# Altium schematic sheet Connectors_GPIOs.SchDoc
size A3
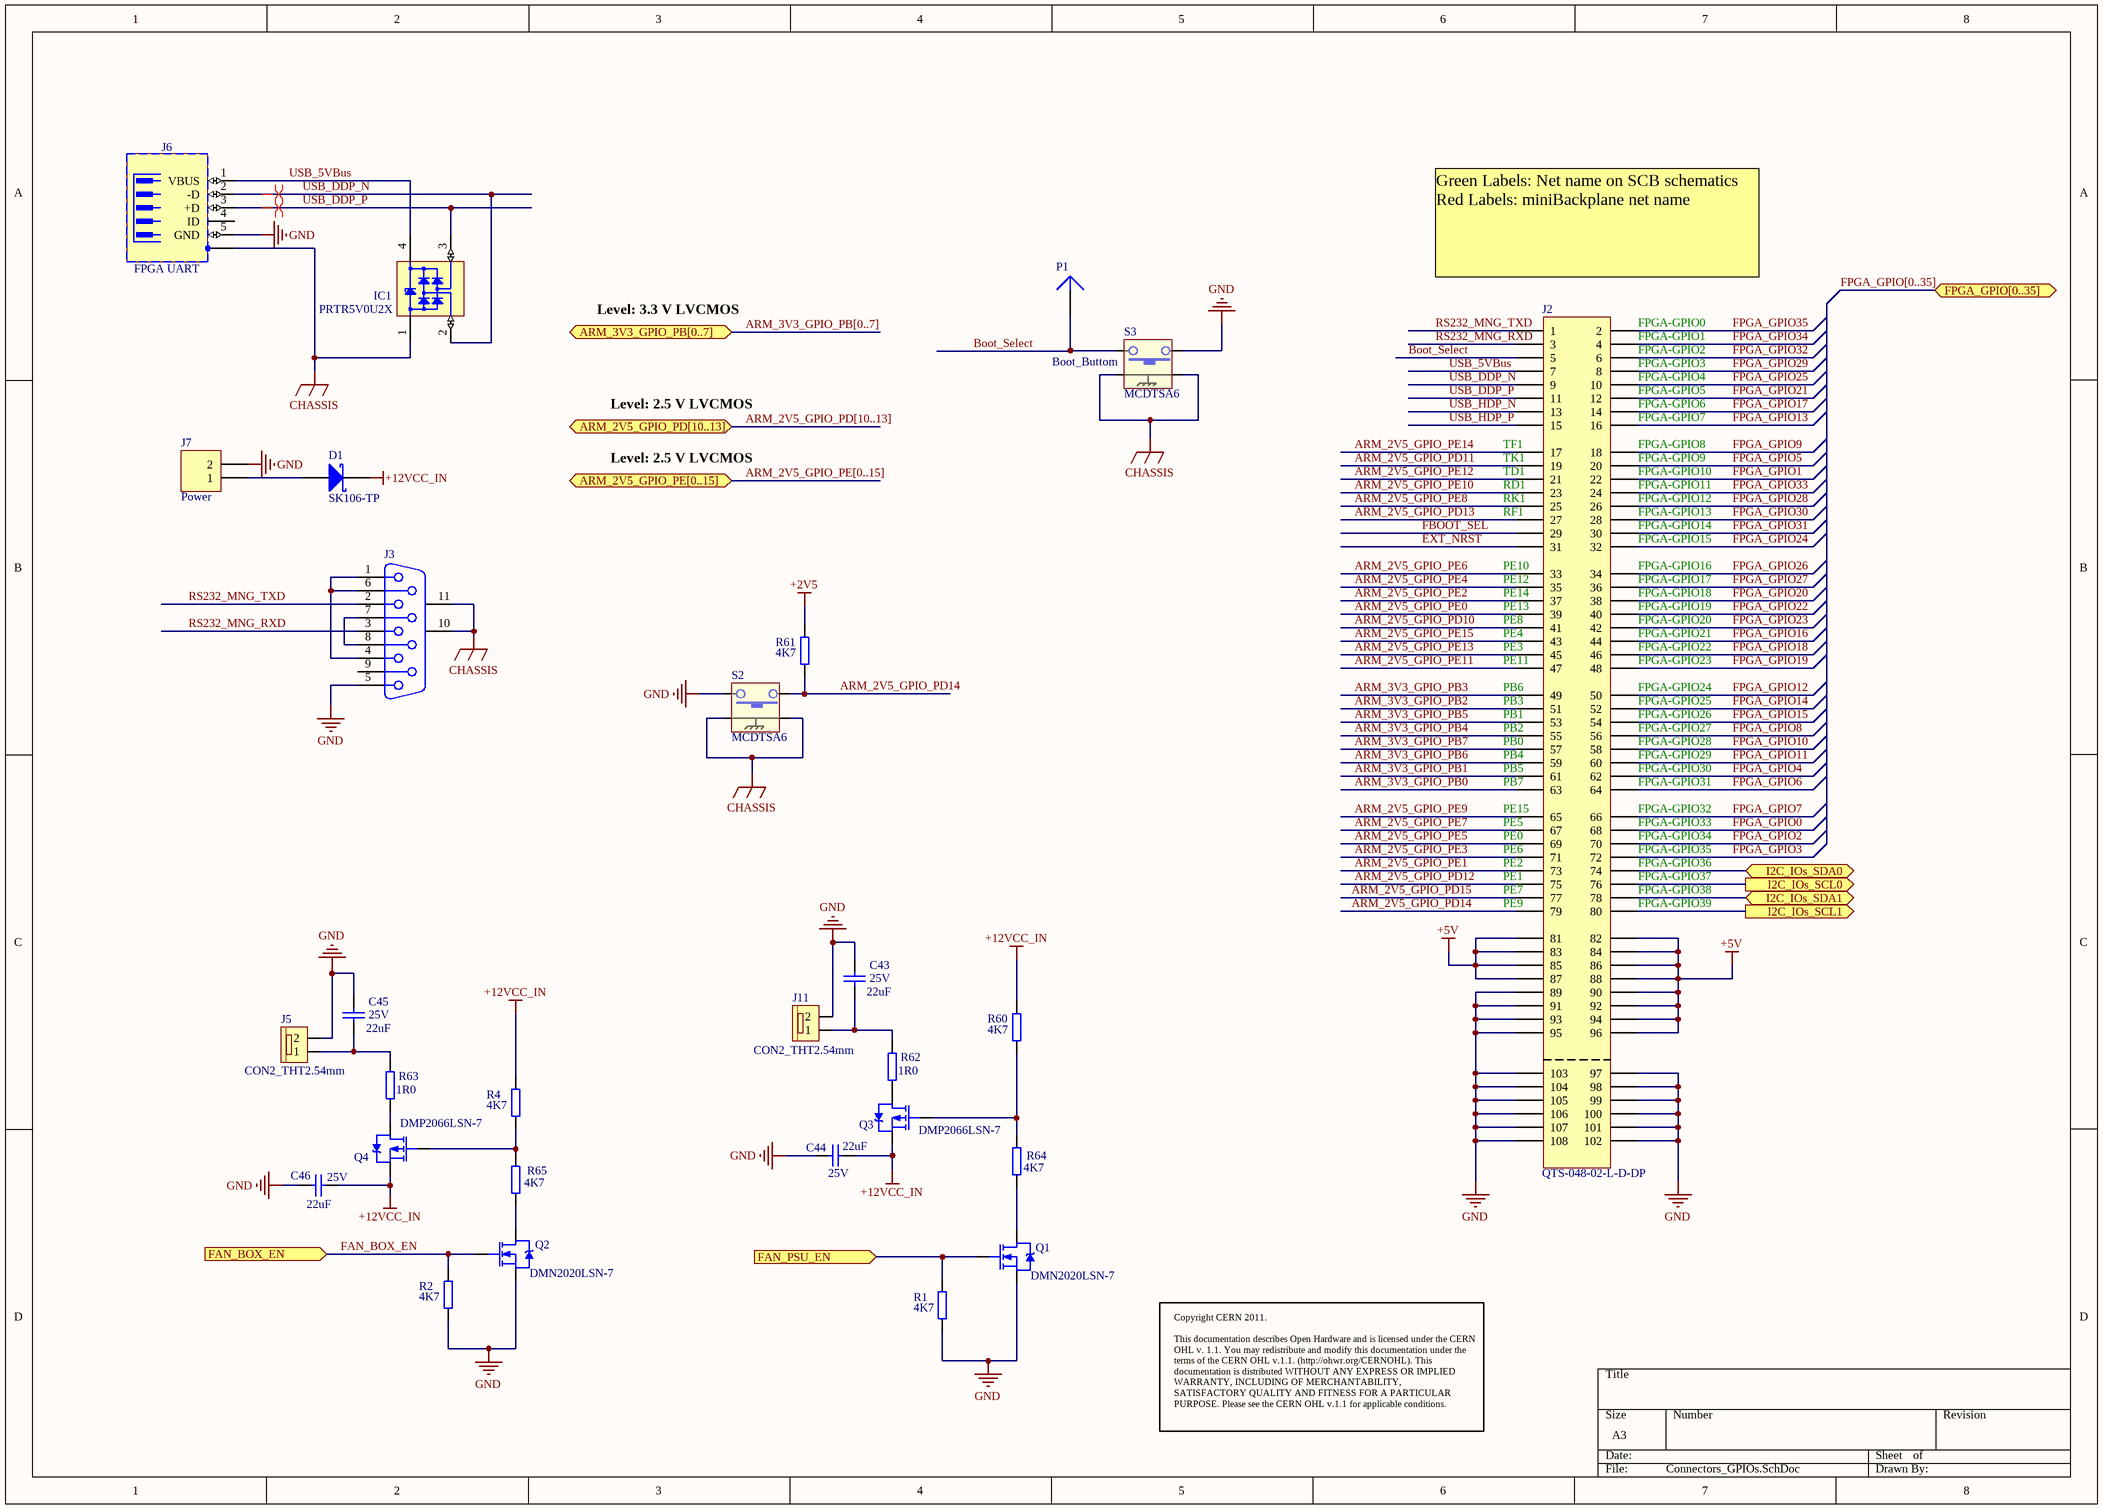
[diagram p0: Connectors_GPIOs.SchDoc]

## Parts
C43  value 22uF  Voltage: 25V  [CC3216-1206]  (hidden comment: 22uF 25V)
C44  value 22uF  Voltage: 25V  [CC3216-1206]  (hidden comment: 22uF 25V)
C45  value 22uF  Voltage: 25V  [CC3216-1206]  (hidden comment: 22uF 25V)
C46  value 22uF  Voltage: 25V  [CC3216-1206]  (hidden comment: 22uF 25V)
D1  SK106-TP  [DO-214AB/SMB-MCC]
IC1  PRTR5V0U2X  [SOT190P230X110-4N]
J2  QTS-048-02-L-D-DP  [QTS-048-XX-X-D-DP-A]
J3  D Connector 9  [DSUB1.385-2H9]  (value not drawn)
J5  CON2_THT2.54mm  [Wurth_619_0xx]
J6  FPGA UART  [TYCO_1734035-1]
J7  Power  [TYCO_794120_1]
J11  CON2_THT2.54mm  [Wurth_619_0xx]
P1  Boot_Buttom  [PIN1-RT-01T-1.0B(LF)]
Q1  DMN2020LSN-7  [SC-59-3]
Q2  DMN2020LSN-7  [SC-59-3]
Q3  DMP2066LSN-7  [SC-59-3]
Q4  DMP2066LSN-7  [SC-59-3]
R1  4K7  [0603]
R2  4K7  [0603]
R4  4K7  [0603]
R60  4K7  [0603]
R61  4K7  [0603]
R62  1R0  [CR3225-1210]
R63  1R0  [CR3225-1210]
R64  4K7  [0603]
R65  4K7  [0603]
S2  MCDTSA6  [MCDTSA6]
S3  MCDTSA6  [MCDTSA6]

## Ports
ARM_2V5_GPIO_PD[10..13] (bidir), ARM_2V5_GPIO_PE[0..15] (bidir), ARM_3V3_GPIO_PB[0..7] (bidir), FAN_BOX_EN (in), FAN_PSU_EN (in), FPGA_GPIO[0..35] (bidir), I2C_IOs_SCL0 (out), I2C_IOs_SCL1 (out), I2C_IOs_SDA0 (bidir), I2C_IOs_SDA1 (bidir)

## Nets
+2V5: R61.1
+5V: J2.81 J2.82 J2.83 J2.84 J2.85 J2.86 J2.87 J2.88 J2.90 J2.92 J2.94 J2.96
+12VCC_IN: C44.1 C46.1 D1.1(K) Q3.3(S) Q4.3(S) R4.1 R60.1
CHASSIS: IC1.1(GND) J3.10(MH1) J3.11(MH2) J6.6(SH) S2.3 S2.4 S3.3 S3.4
GND: C43.2 C44.2 C45.2 C46.2 J2.89 J2.91 J2.93 J2.95 J2.97 J2.98 J2.99 J2.100 J2.101 J2.102 J2.103 J2.104 J2.105 J2.106 J2.107 J2.108 J3.5 J5.2 J6.5(GND) J7.2 J11.2 Q1.3(S) Q2.3(S) R1.2 R2.2 S2.2 S3.1
ARM_2V5_GPIO_PD10: J2.41  [also labelled PE8]
ARM_2V5_GPIO_PD11: J2.19  [also labelled TK1]
ARM_2V5_GPIO_PD12: J2.75  [also labelled PE1]
ARM_2V5_GPIO_PD13: J2.27  [also labelled RF1]
ARM_2V5_GPIO_PD14: J2.79 R61.2 S2.1  [also labelled PE9]
ARM_2V5_GPIO_PD15: J2.77  [also labelled PE7]
ARM_2V5_GPIO_PE0: J2.39  [also labelled PE13]
ARM_2V5_GPIO_PE1: J2.73  [also labelled PE2]
ARM_2V5_GPIO_PE2: J2.37  [also labelled PE14]
ARM_2V5_GPIO_PE3: J2.71  [also labelled PE6]
ARM_2V5_GPIO_PE4: J2.35  [also labelled PE12]
ARM_2V5_GPIO_PE5: J2.69  [also labelled PE0]
ARM_2V5_GPIO_PE6: J2.33  [also labelled PE10]
ARM_2V5_GPIO_PE7: J2.67  [also labelled PE5]
ARM_2V5_GPIO_PE8: J2.25  [also labelled RK1]
ARM_2V5_GPIO_PE9: J2.65  [also labelled PE15]
ARM_2V5_GPIO_PE10: J2.23  [also labelled RD1]
ARM_2V5_GPIO_PE11: J2.47  [also labelled PE11]
ARM_2V5_GPIO_PE12: J2.21  [also labelled TD1]
ARM_2V5_GPIO_PE13: J2.45  [also labelled PE3]
ARM_2V5_GPIO_PE14: J2.17  [also labelled TF1]
ARM_2V5_GPIO_PE15: J2.43  [also labelled PE4]
ARM_3V3_GPIO_PB0: J2.63  [also labelled PB7]
ARM_3V3_GPIO_PB1: J2.61  [also labelled PB5]
ARM_3V3_GPIO_PB2: J2.51  [also labelled PB3]
ARM_3V3_GPIO_PB3: J2.49  [also labelled PB6]
ARM_3V3_GPIO_PB4: J2.55  [also labelled PB2]
ARM_3V3_GPIO_PB5: J2.53  [also labelled PB1]
ARM_3V3_GPIO_PB6: J2.59  [also labelled PB4]
ARM_3V3_GPIO_PB7: J2.57  [also labelled PB0]
Boot_Select: J2.5 P1.1 S3.2
EXT_NRST: J2.31
FAN_BOX_EN: Q2.1(G) R2.1 ; port FAN_BOX_EN
FAN_PSU_EN: Q1.1(G) R1.1 ; port FAN_PSU_EN
FBOOT_SEL: J2.29
FPGA-GPIO0: J2.2  [also labelled FPGA_GPIO35]
FPGA-GPIO1: J2.4  [also labelled FPGA_GPIO34]
FPGA-GPIO2: J2.6  [also labelled FPGA_GPIO32]
FPGA-GPIO3: J2.8  [also labelled FPGA_GPIO29]
FPGA-GPIO4: J2.10  [also labelled FPGA_GPIO25]
FPGA-GPIO5: J2.12  [also labelled FPGA_GPIO21]
FPGA-GPIO6: J2.14  [also labelled FPGA_GPIO17]
FPGA-GPIO7: J2.16  [also labelled FPGA_GPIO13]
FPGA-GPIO8: J2.18  [also labelled FPGA_GPIO9]
FPGA-GPIO9: J2.20  [also labelled FPGA_GPIO5]
FPGA-GPIO10: J2.22  [also labelled FPGA_GPIO1]
FPGA-GPIO11: J2.24  [also labelled FPGA_GPIO33]
FPGA-GPIO12: J2.26  [also labelled FPGA_GPIO28]
FPGA-GPIO13: J2.28  [also labelled FPGA_GPIO30]
FPGA-GPIO14: J2.30  [also labelled FPGA_GPIO31]
FPGA-GPIO15: J2.32  [also labelled FPGA_GPIO24]
FPGA-GPIO16: J2.34  [also labelled FPGA_GPIO26]
FPGA-GPIO17: J2.36  [also labelled FPGA_GPIO27]
FPGA-GPIO18: J2.38  [also labelled FPGA_GPIO20]
FPGA-GPIO19: J2.40  [also labelled FPGA_GPIO22]
FPGA-GPIO20: J2.42  [also labelled FPGA_GPIO23]
FPGA-GPIO21: J2.44  [also labelled FPGA_GPIO16]
FPGA-GPIO22: J2.46  [also labelled FPGA_GPIO18]
FPGA-GPIO23: J2.48  [also labelled FPGA_GPIO19]
FPGA-GPIO24: J2.50  [also labelled FPGA_GPIO12]
FPGA-GPIO25: J2.52  [also labelled FPGA_GPIO14]
FPGA-GPIO26: J2.54  [also labelled FPGA_GPIO15]
FPGA-GPIO27: J2.56  [also labelled FPGA_GPIO8]
FPGA-GPIO28: J2.58  [also labelled FPGA_GPIO10]
FPGA-GPIO29: J2.60  [also labelled FPGA_GPIO11]
FPGA-GPIO30: J2.62  [also labelled FPGA_GPIO4]
FPGA-GPIO31: J2.64  [also labelled FPGA_GPIO6]
FPGA-GPIO32: J2.66  [also labelled FPGA_GPIO7]
FPGA-GPIO33: J2.68  [also labelled FPGA_GPIO0]
FPGA-GPIO34: J2.70  [also labelled FPGA_GPIO2]
FPGA-GPIO35: J2.72  [also labelled FPGA_GPIO3]
FPGA-GPIO36: J2.74 ; port I2C_IOs_SDA0
FPGA-GPIO37: J2.76 ; port I2C_IOs_SCL0
FPGA-GPIO38: J2.78 ; port I2C_IOs_SDA1
FPGA-GPIO39: J2.80 ; port I2C_IOs_SCL1
RS232_MNG_RXD: J2.3 J3.3
RS232_MNG_TXD: J2.1 J3.2
USB_5VBus: IC1.4(VCC) J2.7 J6.1(VBUS)
USB_DDP_N: IC1.2(I/O1) J2.9 J6.2(-D)
USB_DDP_P: IC1.3(I/O2) J2.11 J6.3(+D)
USB_HDP_N: J2.13
USB_HDP_P: J2.15
NetC43_1: C43.1 J11.1 R62.2
NetC45_1: C45.1 J5.1 R63.2
NetD1_2: D1.2(A) J7.1
NetJ3_1: J3.1 J3.4 J3.6
NetJ3_7: J3.7 J3.8
NetQ1_2: Q1.2(D) R64.2
NetQ2_2: Q2.2(D) R65.2
NetQ3_1: Q3.1(G) R60.2 R64.1
NetQ3_2: Q3.2(D) R62.1
NetQ4_1: Q4.1(G) R4.2 R65.1
NetQ4_2: Q4.2(D) R63.1

Not connected (* = marked no-connect by the designer): J3 9; J6 4(ID)

## Buses and harness runs
bus ARM_2V5_GPIO_PD[10..13] = port ARM_2V5_GPIO_PD[10..13]
bus ARM_2V5_GPIO_PE[0..15] = port ARM_2V5_GPIO_PE[0..15]
bus ARM_3V3_GPIO_PB[0..7] = port ARM_3V3_GPIO_PB[0..7]
bus FPGA_GPIO[0..35] = port FPGA_GPIO[0..35]

## Layout directives
differential pair: USB_DDP_N, USB_DDP_P

## Notes on the sheet
- Level: 3.3 V LVCMOS
- Green Labels: Net name on SCB schematics
  Red Labels: miniBackplane net name
- Level: 2.5 V LVCMOS
- Copyright CERN 2011.
  This documentation describes Open Hardware and is licensed under the CERN OHL v. 1.1. You may redistribute and modify this documentation under the terms of the CERN OHL v.1.1. (http://ohwr.org/CERNOHL). This documentation is distributed WITHOUT ANY EXPRESS OR IMPLIED WARRANTY, INCLUDING OF MERCHANTABILITY, SATISFACTORY QUALITY AND FITNESS FOR A PARTICULAR PURPOSE. Please see the CERN OHL v.1.1 for applicable conditions.

## Library data of the parts
C43-C46 = CC1206_22UF_25V_10%_X5R: Capacitor; Manufacturer1: Murata; Manufacturer1 PN: GRM31CR61E226KE15L; TC: X5R; Tolerance: ±10%; Published: 8-Jun-2000; LatestRevisionDate: 17-Jul-2002; LatestRevisionNote: Re-released for DXP Platform.; PackageReference: RAD-0.3; Publisher: Altium Limited; Distributor1: Digikey; Distributor1 PN: 490-5527-1-ND; Case: 1206
D1 = SK106-TP: Schottky Diode 10A 60V; Manufacturer1: Micro Commercial Components; Distributor1 PN: SK106-TPCT-ND; Manufacturer1 PN: SK106-TP; Distributor1: Digikey
IC1 = PRTR5V0U2X: Ultra Low Capacitance Double Rail-to-Rail ESD Protection Diode; Part Description: Ultra Low Capacitance (1pF) Double Rail-to-Rail ESD Protection Diode (8kV); Manufacturer: PHILIPS NXP; Voltage: 5.5V; Table: Diodes; Part Number: PRTR5V0U2X; Component Kind: Standard; Component Type: Standard; Device: PRTR5V0U2X; PackageDescription: SOT143B, SOT, 1.90mm Pitch; 4 Pin, 1.30mm W X 2.90mm L X 1.10mm H body, IPC Medium Density; Manufacturer Part Number: PRTR5V0U2X; Pin Count: 4; Case: SOT143B; Mounted: Yes; Socket: No; SMD: Yes; ComponentHeight: 1.1mm; HelpURL: \\cern.ch\dfs\Applications\Altium\Datasheets\PRTR5V0U2X.pdf; Author: CERN DEM JLC; CreateDate: 3/22/2011; LatestRevisionDate: 3/22/2011
J2 = QTS-048-01-L-D-DP: High Speed Ground Plane Header; Manufacturer1: Samtec; Manufacturer1 PN: QTS-048-01-L-D-DP
J3 = D Connector 9: Receptacle Assembly, 9 Position, Right Angle; Manufacturer1 PN: 1734348-1; Manufacturer1: TE Connectivity; PackageDocument: O; Positions: 9; Published: 15-Jun-2001; LatestRevisionDate: 17-Jul-2002; LatestRevisionNote: Re-released for DXP Platform.; DatasheetDocument: 1-Sep-1999; PackageReference: 788750; Publisher: Altium Limited; Orientation: Right Angle; Gender: Receptacle; Distributor1: Digikey; Distributor1 PN: A35109-ND
J5 J11 = CON2_619_0xx: Connector; Manufacturer1 PN: 61900211121; Manufacturer1: Wurth; Distributor1: Digikey; Distributor1 PN: 732-2695-ND
J6 = TYCO_1734035-1: 5 Pin + 1 Shield USB Receptacle; Part Description: 5 Position, Right Angle, SMD Mini USB Type B Receptacle; Manufacturer: TYCO ELECTRONICS; Table: TYCO; Part Number: TYCO_1734035-1; Component Kind: Standard; Component Type: Standard; Pin Count: 6; Family: USB; Mounted: Yes; Socket: No; SMD: Yes; Status: None; Manufacturer Part Number: 1734035-1; ComponentHeight: 3.95mm; HelpURL: \\cern.ch\dfs\Applications\Altium\Datasheets\TYCO_1734035-1.pdf; Author: CERN DEM JLC; CreateDate: 02/05/2011; LatestRevisionDate: 02/05/2011
J7 = Header 2: Header, 2-Pin; Manufacturer1 PN: 794120-1; Manufacturer1: Tyco Electronics; LatestRevisionDate: 17-Jul-2002; LatestRevisionNote: Re-released for DXP Platform.; Publisher: Altium Limited; Distributor1: Digikey; Distributor1 PN: A25753-ND
P1 = Plug: Manufacturer1 PN: RT-01T-1.0B(LF); Manufacturer1: JST; LatestRevisionDate: 17-Jul-2002; LatestRevisionNote: Re-released for DXP Platform.; Publisher: Altium Limited; Distributor1: Farnell; Distributor1 PN: 9492208
Q1 Q2 = DMN2020LSN-7: N-Channel Power MOSFET; Manufacturer: Diodes Inc.; Published: 8-Jun-2000; LatestRevisionDate: 17-Jul-2002; LatestRevisionNote: Re-released for DXP Platform.; DatasheetVersion: PD-9.814; Publisher: Altium Limited; ComponentLink1Description: Manufacturer Link; ComponentLink1URL: http://www.irf.com/; Value: DMN2020LSN-7; Distributor1: Digikey; Distributor1 PN: DMN2020LSN-7DICT-ND
Q3 Q4 = DMP2066LSN-7: P-Channel Enhancement MOSFET; Manufacturer: Diodes Inc.; Distributor1 PN: DMP2066LSNDICT-ND; Distributor1: Digikey; Case: SC-59; Manufacturer PN: DMP2066LSN-7
R1 R2 R4 R60 R61 R64 R65 = R0603_4.7K_±1%_0.1W_100PPM: SMD Resistor; Manufacturer1: Panasonic; Manufacturer1 PN: ERJ-3EKF4701V; TCR: 100ppm; Power Rating: 0.1W; Tolerance: ±1%; Case: 0603; Distributor1: DigiKey; Distributor1 PN: P4.70KHCT-ND; Value: 4K7
R62 R63 = R1210_1R0_±1%_1W_100PPM: SMD Resistor; Manufacturer1: Vishay Dale; Manufacturer1 PN: CRCW12101R00FKEA; TCR: 100ppm; Power Rating: 0.1W; Tolerance: ±1%; Case: 1210; Distributor1: DigiKey; Distributor1 PN: 541-1.00AAACT-ND; Value: 1R0
S2 S3 = MCDTSA6: Push button SPNO Right Angle Through Hole; Manufacturer1 PN: MCDTSA6-5K; Manufacturer1: Multicomp; Distributor1: Farnell; Distributor1 PN: 9471790